# EAGLE design board (EAGLE 9.5.2)
CNAME: Fume Extractor PCB; CREVISION: 1.0; DESIGNER: Kihun Song

## Sheet 1 of 2
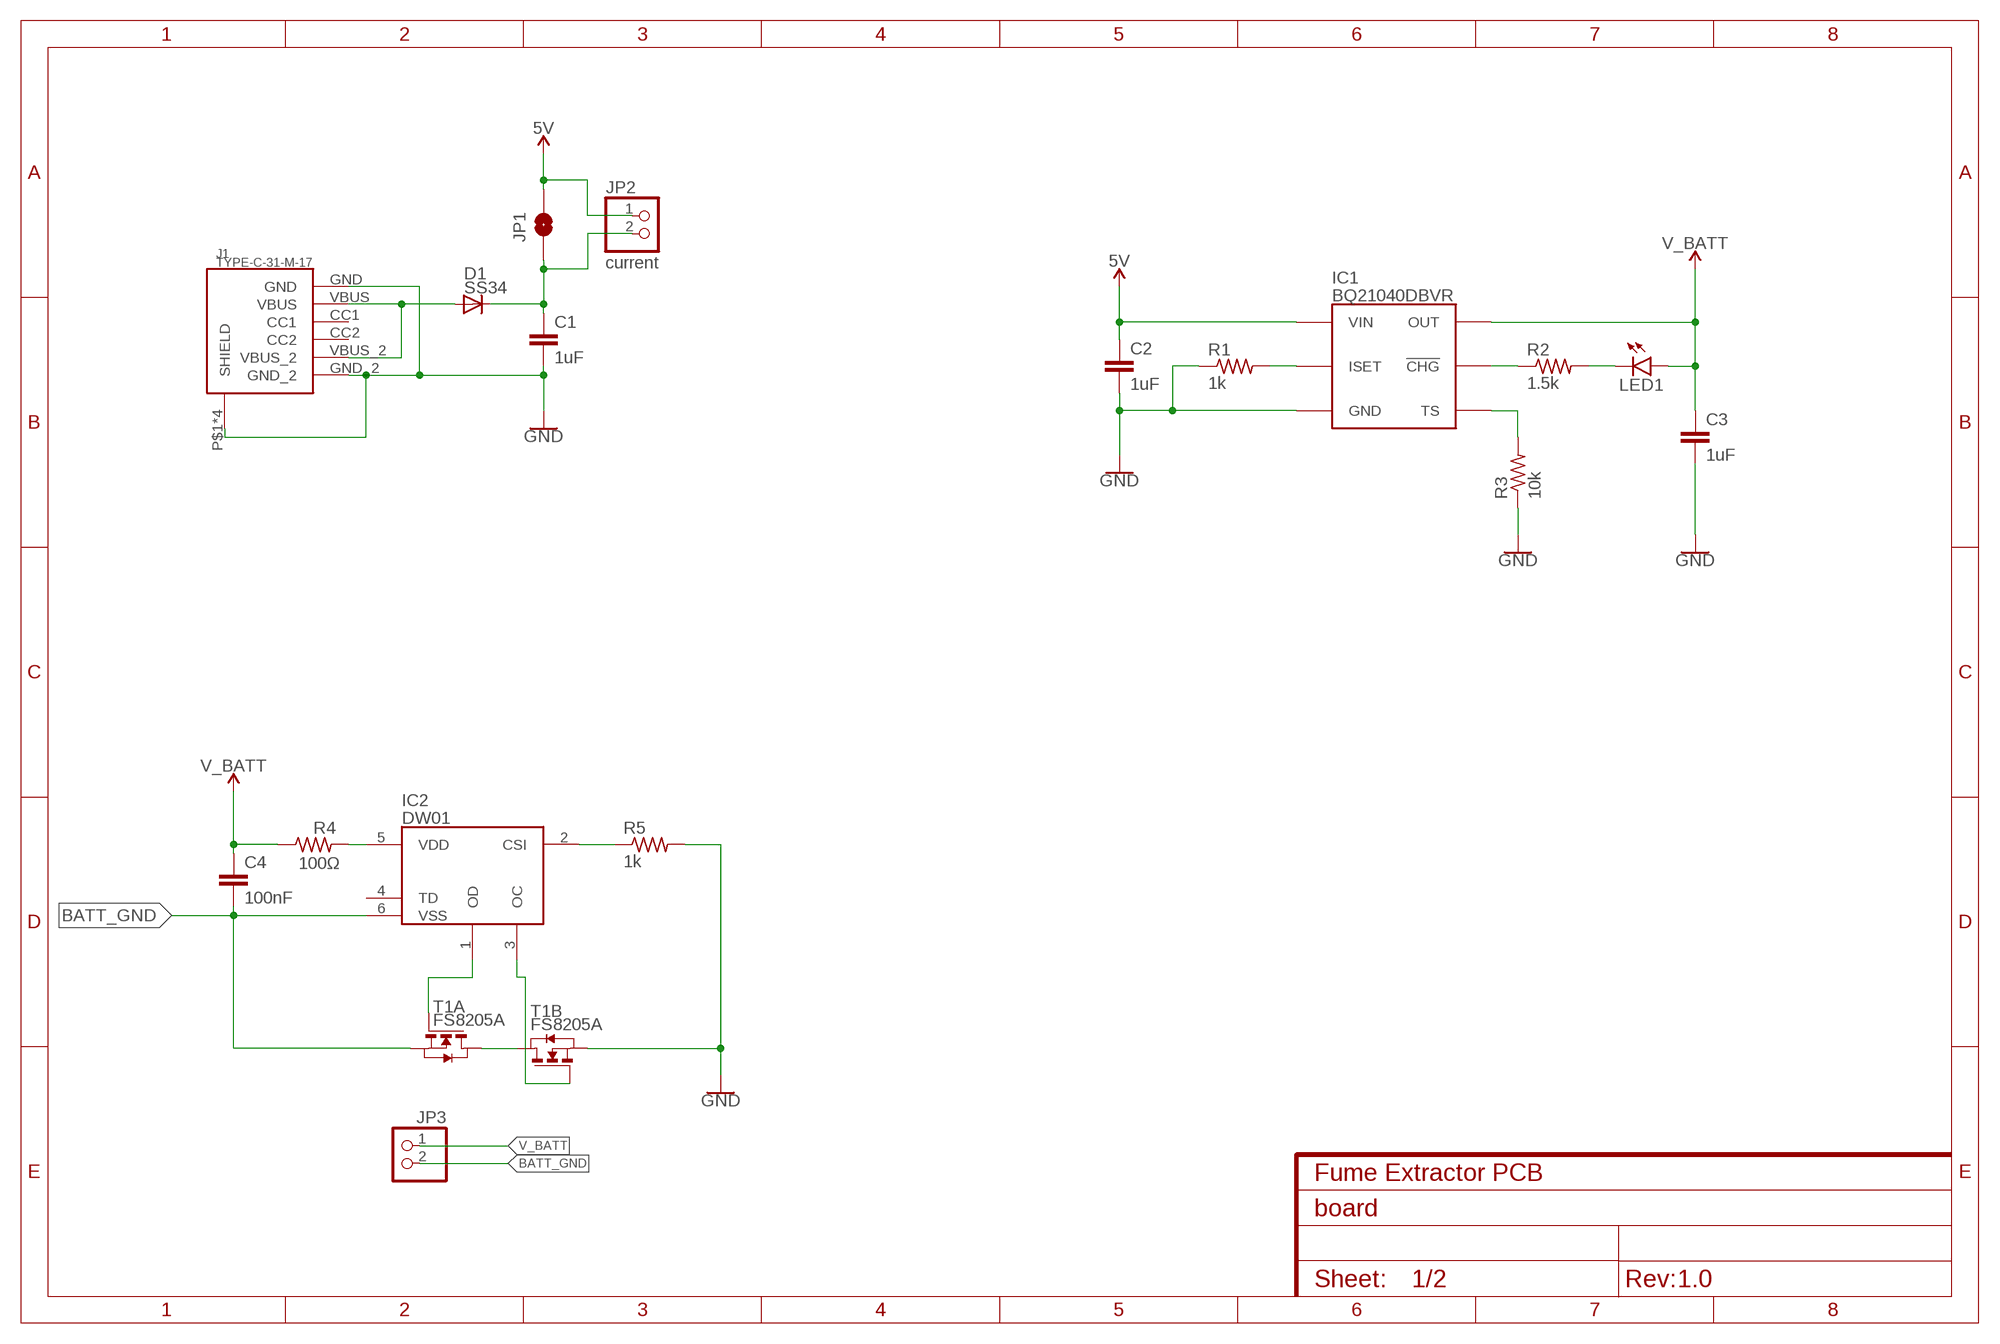
[diagram p0: schematic, sheet 1]

### Parts
C1  1uF  C-EUC0603  [C0603]
C2  1uF  C-EUC0603  [C0603]
C3  1uF  C-EUC0603  [C0603]
C4  100nF  C-EUC0603  [C0603]
D1  SS34  DIODE-DO214AC  [DO214AC]
IC1  BQ21040DBVR  [SOT95P280X145-6N]
IC2  DW01  [SOT95P280X135-6N]
J1  TYPE-C-31-M-17  [TYPE-C-31-M-17]
JP1  JUMPER-SMT_2_NO_NO-SILK  [SMT-JUMPER_2_NO_NO-SILK]
JP2  current  PINHD-1X2/OCT  [1X02/OCT]
JP3  PINHD-1X2/OCT  [1X02/OCT]
LED1  LEDCHIP-LED0805  [CHIP-LED0805]
R1  1k  R-US_R0603  [R0603]
R2  1.5k  R-US_R0603  [R0603]
R3  10k  R-US_R0603  [R0603]
R4  100Ω  R-US_R0603  [R0603]
R5  1k  R-US_R0603  [R0603]
T1  FS8205A  FS8205A-MOSFET  [TSSOP-8]

### Nets
5V [power]: C2.1 IC1.6(VIN) JP1.2 JP2.1 ; also sheet 2
BATT_GND [power]: C4.2 IC2.6(VSS) JP3.2 T1.2(A:S) T1.3(A:S)
GND [power]: C1.2 C2.2 C3.2 IC1.5(GND) J1.GND J1.GND_2 J1.P$1(SHIELD) J1.P$2(SHIELD) J1.P$3(SHIELD) J1.P$4(SHIELD) R1.1 R3.1 R5.2 T1.6(B:S) T1.7(B:S) ; also sheet 2
N$1 [power]: IC2.5(VDD) R4.2
N$2: IC1.1(TS) R3.2
N$3: IC1.3(!CHG) R2.1
N$4: IC2.2(CSI) R5.1
N$5 [power]: T1.1(A:D) T1.8(B:D)
N$6: IC2.1(OD) T1.4(A:G)
N$7: IC2.3(OC) T1.5(B:G)
N$8: LED1.C R2.2
N$9: IC1.4(ISET) R1.2
N$13 [power]: C1.1 D1.C JP1.1 JP2.2
N$14 [power]: D1.A J1.VBUS J1.VBUS_2
V_BATT [power]: C3.1 C4.1 IC1.2(OUT) JP3.1 LED1.A R4.1
Unconnected: IC2.4(TD) J1.CC1 J1.CC2

## Sheet 2 of 2
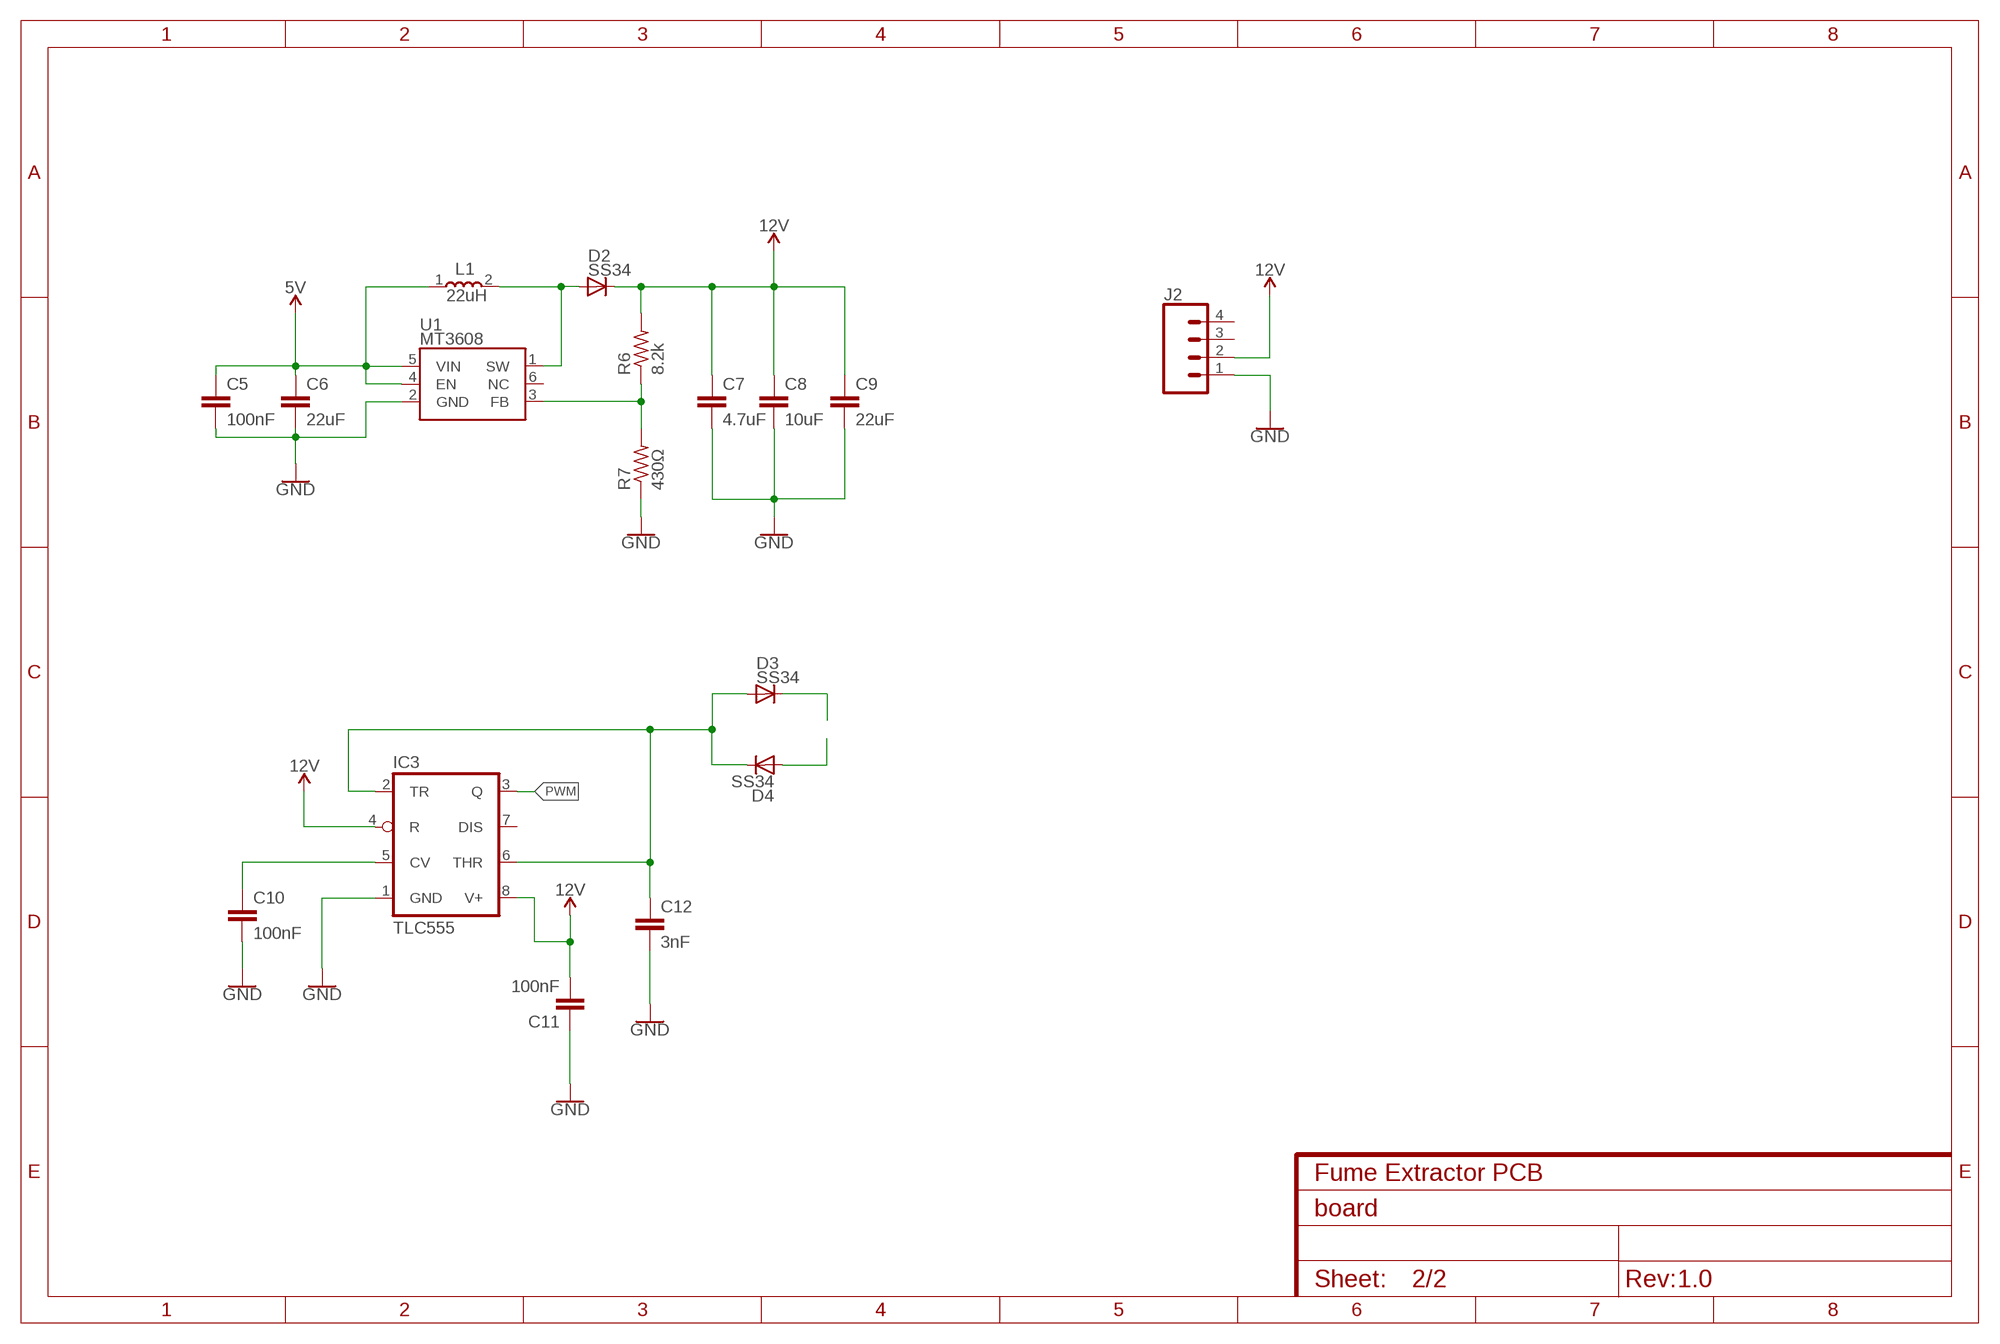
[diagram p1: schematic, sheet 2]

### Parts
C5  100nF  C-EUC0603  [C0603]
C6  22uF  C-EUC0805  [C0805]
C7  4.7uF  C-EUC0603  [C0603]
C8  10uF  C-EUC0805  [C0805]
C9  22uF  C-EUC0805  [C0805]
C10  100nF  C-EUC0603  [C0603]
C11  100nF  C-EUC0603  [C0603]
C12  3nF  C-EUC0603  [C0603]
D2  SS34  DIODE-DO214AC  [DO214AC]
D3  SS34  DIODE-DO214AC  [DO214AC]
D4  SS34  DIODE-DO214AC  [DO214AC]
IC3  TLC555  NE555D  [SO08]
J2  CONN_04POLAR_LOCK  [MOLEX-1X4_LOCK]
L1  22uH  BCIHP0730-220M  [INDPM7066X300N]
R6  8.2k  R-US_R0603  [R0603]
R7  430Ω  R-US_R0603  [R0603]
U1  MT3608  [SOT23-6]

### Nets
5V [power]: C5.1 C6.1 L1.1 U1.4(EN) U1.5(VIN) ; also sheet 1
12V [power]: C7.1 C8.1 C9.1 C11.2 D2.C IC3.4(R) IC3.8(V+) J2.2 R6.2
GND [power]: C5.2 C6.2 C7.2 C8.2 C9.2 C10.2 C11.1 C12.2 IC3.1(GND) J2.1 R7.1 U1.2(GND) ; also sheet 1
N$10 [power]: D2.A L1.2 U1.1(SW)
N$11: C10.1 IC3.5(CV)
N$12: R6.1 R7.2 U1.3(FB)
N$15: C12.1 D3.A D4.C IC3.2(TR) IC3.6(THR)
N$16: D3.C
N$17: D4.A
PWM: IC3.3(Q)
Unconnected: IC3.7(DIS) J2.3 J2.4 U1.6(NC)

## Library data of the parts
C1-C12 = rcl:C-EU: CAPACITOR, European symbol; SPICEPREFIX: C
D1-D4 = diode:DIODE-: DIODE
IC1 = SamacSys_Parts:BQ21040DBVR: 0.8A Single Input Single-Cell Li-Ion and Li-Pol Battery Charger Source: Datasheet <http://www.ti.com/lit/gpn/bq21040>; DESCRIPTION: 0.8A Single Input Single-Cell Li-Ion and Li-Pol Battery Charger; HEIGHT: 1.45mm; MANUFACTURER_NAME: Texas Instruments; MANUFACTURER_PART_NUMBER: BQ21040DBVR; MOUSER_PART_NUMBER: 595-BQ21040DBVR; MOUSER_PRICE-STOCK: https://www.mouser.com/Search/Refine.aspx?Keyword=595-BQ21040DBVR
IC2 = DW01:DW01: ic Source: Datasheet <https://datasheet.lcsc.com/szlcsc/1906271838_SLKORMICRO-Elec-DW01_C359989.pdf>; DESCRIPTION: ic; HEIGHT: 1.35mm; MANUFACTURER_NAME: Slkor; MANUFACTURER_PART_NUMBER: DW01
IC3 = linear:*555: TIMER
J1 = Type-C_Hroparts:TYPE-C-31-M-17
J2 = SparkFun-Connectors:CONN_04: Multi connection point. Often used as Generic Header-pin footprint for 0.1 inch spaced/style header connections On any of the 0.1 inch spaced packages, you can populate with these: Break Away Headers - Straight <https://www.sparkfun.com/products/116> (PRT-00116) Break Away Male Headers - Right Angle <https://www.sparkfun.com/products/553> (PRT-00553) Female Headers <https://www.sparkfun.com/products/115> (PRT-00115) Break Away Headers - Machine Pin <https://www.sparkfun.com/products/117> (PRT-00117) Break Away Female Headers - Swiss Machine Pin <https://www.sparkfun.com/products/743> (PRT-00743) For SCREWTERMINALS and SPRING TERMINALS visit here: Screw Terimnals on SparkFun.com <https://www.sparkfun.com/search/results?term=Screw+Terminals> (5mm/3.5mm/2.54mm spacing) This device is also useful as a general connection point to wire up your design to another part of your project. Our various solder wires solder well into these plated through hole pads. Hook-Up Wire - Assortment (Stranded, 22 AWG) <https://www.sparkfun.com/products/11375> (PRT-11375) Hook-Up Wire - Assortment (Solid Core, 22 AWG) <https://www.sparkfun.com/products/11367> (PRT-11367) View the entire wire category on our website here <https://www.sparkfun.com/categories/141> Special notes: Molex polarized connector foot print use with SKU : PRT-08231 with associated crimp pins and housings. 1MM SMD Version SKU: PRT-10208; PROD_ID: CONN-08186; SF_ID: PRT-08231
JP1 = SparkFun-Jumpers:JUMPER-SMT_2_NO: Normally open jumper This jumper has two pads in close proximity to each other. Apply solder to close the connection. Round pads are easier to solder for beginners, but are a lot larger. SparkFun Product that uses the round pads: SparkFun EL Sequencer <https://www.sparkfun.com/products/12781>
JP2 JP3 = pinhead_v2:PINHD-1X2: PIN HEADER
L1 = BCIHP0730-220M:BCIHP0730-220M: Inductors (SMD) SMD,7x7x3mm RoHS Source: Datasheet <https://datasheet.lcsc.com/szlcsc/Bao-Cheng-Elec-BC-BCIHP0730-220M_C237916.pdf>; DESCRIPTION: Inductors (SMD) SMD,7x7x3mm RoHS; HEIGHT: 3mm; MANUFACTURER_NAME: Bao Cheng Elec; MANUFACTURER_PART_NUMBER: BCIHP0730-220M
LED1 = led:LED: LED OSRAM: - CHIPLED LG R971, LG N971, LY N971, LG Q971, LY Q971, LO R971, LY R971 LH N974, LH R974 LS Q976, LO Q976, LY Q976 LO Q996 - Hyper CHIPLED LW Q18S LB Q993, LB Q99A, LB R99A - SideLED LS A670, LO A670, LY A670, LG A670, LP A670 LB A673, LV A673, LT A673, LW A673 LH A674 LY A675 LS A676, LA A676, LO A676, LY A676, LW A676 LS A679, LY A679, LG A679 - Hyper Micro SIDELED® LS Y876, LA Y876, LO Y876, LY Y876 LT Y87S - SmartLED LW L88C, LW L88S LB L89C, LB L89S, LG L890 LS L89K, LO L89K, LY L89K LS L896, LA L896, LO L896, LY L896 - TOPLED LS T670, LO T670, LY T670, LG T670, LP T670 LSG T670, LSP T670, LSY T670, LOP T670, LYG T670 LG T671, LOG T671, LSG T671 LB T673, LV T673, LT T673, LW T673 LH T674 LS T676, LA T676, LO T676, LY T676, LB T676, LH T676, LSB T676, LW T676 LB T67C, LV T67C, LT T67C, LS T67K, LO T67K, LY T67K, LW E67C LS E67B, LA E67B, LO E67B, LY E67B, LB E67C, LV E67C, LT E67C LW T67C LS T679, LY T679, LG T679 LS T770, LO T770, LY T770, LG T770, LP T770 LB T773, LV T773, LT T773, LW T773 LH T774 LS E675, LA E675, LY E675, LS T675 LS T776, LA T776, LO T776, LY T776, LB T776 LHGB T686 LT T68C, LB T68C - Hyper Mini TOPLED® LB M676 - Mini TOPLED Santana® LG M470 LS M47K, LO M47K, LY M47K Source: http://www.osram.convergy.de LUXEON: - LUMILED® LXK2-PW12-R00, LXK2-PW12-S00, LXK2-PW14-U00, LXK2-PW14-V00 LXK2-PM12-R00, LXK2-PM12-S00, LXK2-PM14-U00 LXK2-PE12-Q00, LXK2-PE12-R00, LXK2-PE12-S00, LXK2-PE14-T00, LXK2-PE14-U00 LXK2-PB12-K00, LXK2-PB12-L00, LXK2-PB12-M00, LXK2-PB14-N00, LXK2-PB14-P00, LXK2-PB14-Q00 LXK2-PR12-L00, LXK2-PR12-M00, LXK2-PR14-Q00, LXK2-PR14-R00 LXK2-PD12-Q00, LXK2-PD12-R00, LXK2-PD12-S00 LXK2-PH12-R00, LXK2-PH12-S00 LXK2-PL12-P00, LXK2-PL12-Q00, LXK2-PL12-R00 Source: www.luxeon.com KINGBRIGHT: KA-3528ASYC Source: www.kingbright.com
R1-R7 = rcl:R-US_: RESISTOR, American symbol; SPICEPREFIX: R
T1 = FS8205A:FS8205A-MOSFET: DUAL N-CHANNEL ENHANCEMENT MODE MOSFET data sheet <http://goo.gl/dRgboR> Dave.Calaway Eagle Library <https://goo.gl/Muy1Tr>
U1 = buckboost:MT3608

## Net classes
0 default: width 0.203 mm
1 power: width 0.457 mm

## Board
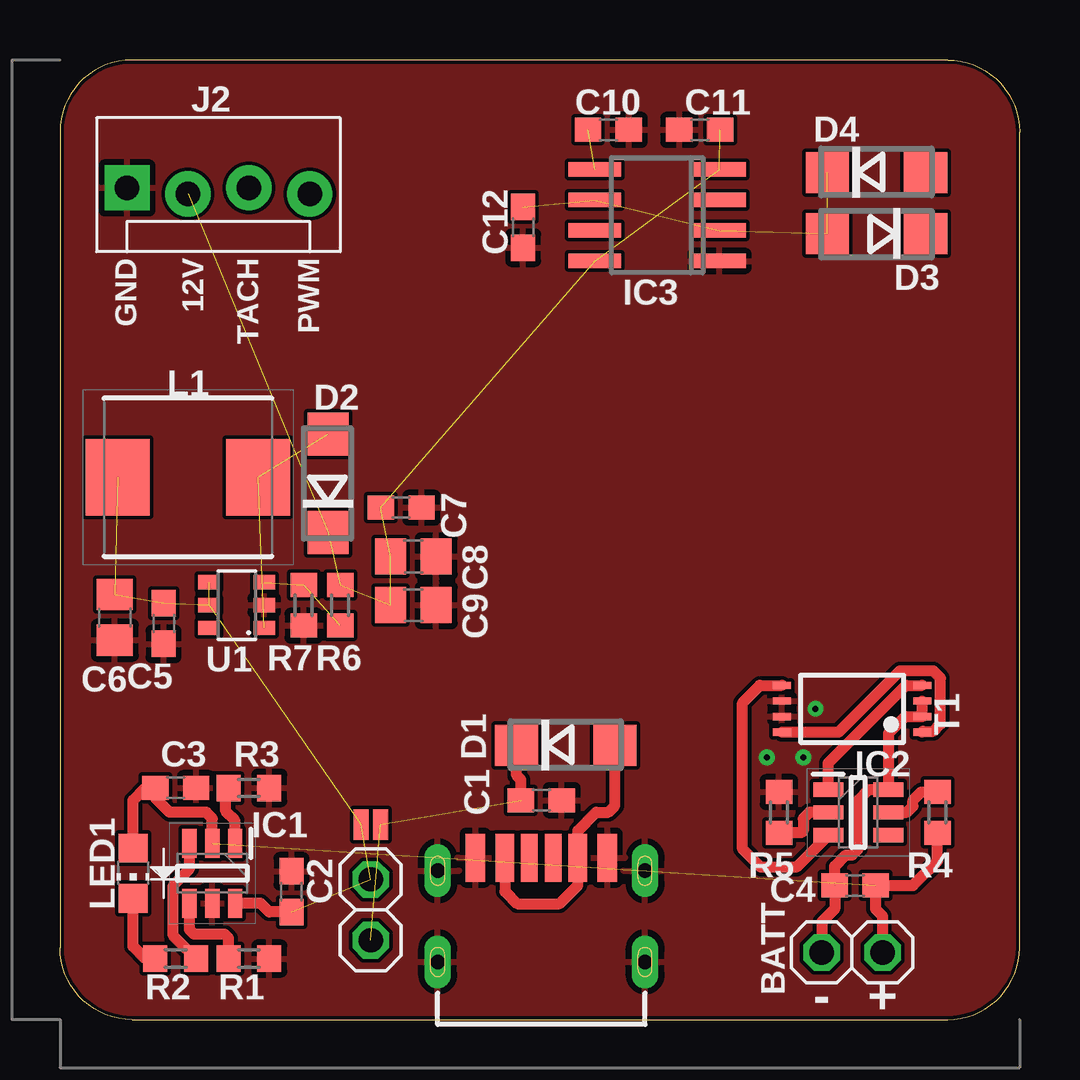
[diagram p2: board, top side]
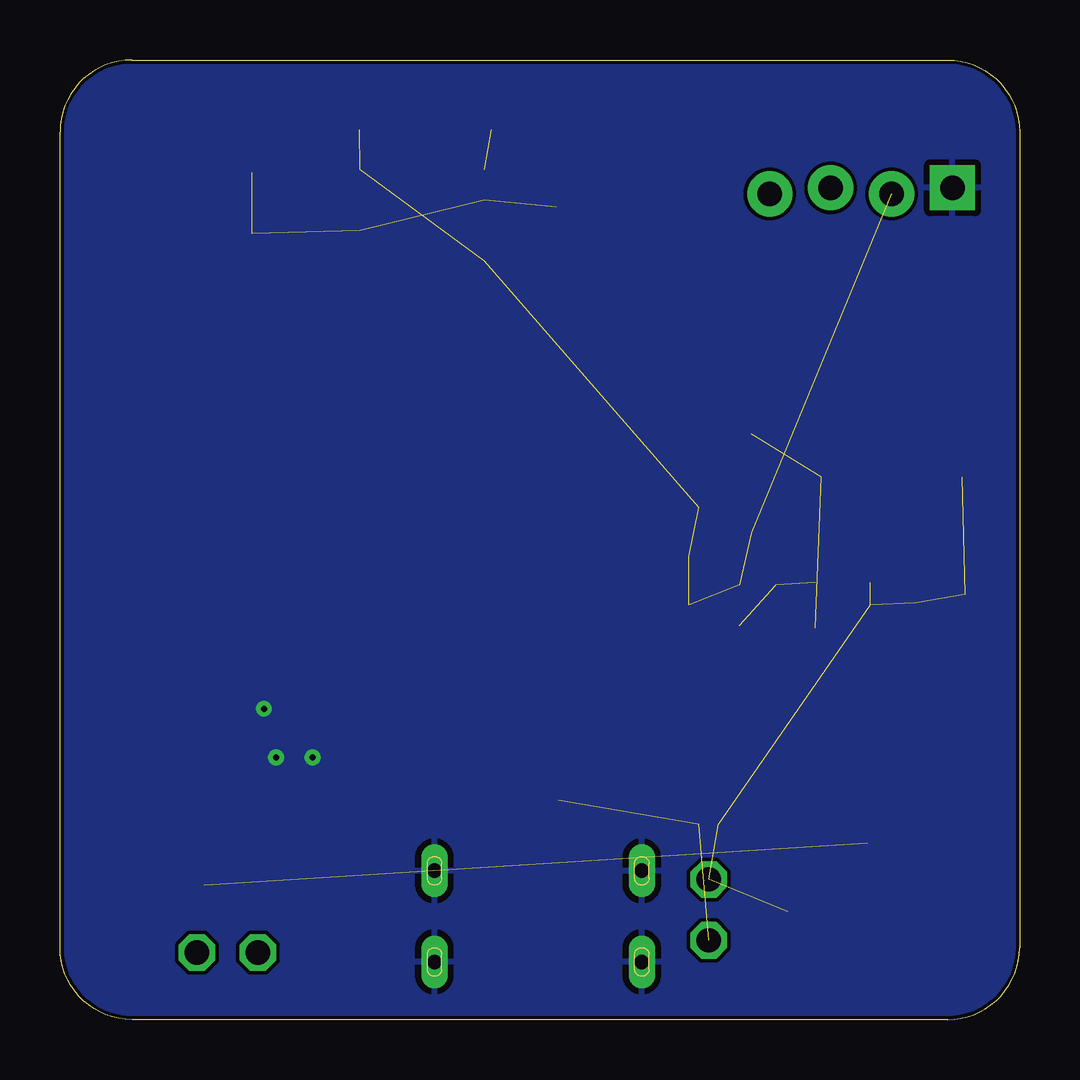
[diagram p3: board, bottom side, seen from below]

Size 40 x 40 mm. Coordinates in mm from the lower left corner, seen from the top.
Outline: 3,0 37,0 arc90 40,3 40,37 arc90 37,40 3,40 arc90 0,37 0,3 arc90 3,0
Copper layers (1*16): Top 0.035mm / dielectric 1.5mm / Bottom 0.035mm
Design rules "default *": minimum track width 6mil, minimum drill 0.35mm, track to track 6mil, track to pad 6mil, pad to pad 6mil, via to via 6mil, smd to smd 6mil, copper to edge 6mil, drill to drill 6mil, minimum pad ring 10mil, minimum via ring 8mil, stop-mask expansion 4mil, vias tented up to drill 0mil, thermal gap 10mil

### Footprints (pad centres in the part's own frame; a part is rotated, then mirrored left to right if it is on the bottom)
C0603 = smd 1.1 x 1: 1 -0.85,0; 2 0.85,0
C0805 = smd 1.3 x 1.5: 1 -0.95,0; 2 0.95,0
DO214AC = smd 1.8 x 1.7: A 2.05,0; C -2.05,0
SOT95P280X145-6N = smd 1.2 x 0.6: 1 -1.25,0.95; 2 -1.25,0; 3 -1.25,-0.95; 4 1.25,-0.95; 5 1.25,0; 6 1.25,0.95
SOT95P280X135-6N = smd 1.25 x 0.6: 1 -1.25,0.95; 2 -1.25,0; 3 -1.25,-0.95; 4 1.25,-0.95; 5 1.25,0; 6 1.25,0.95
SO08 = smd 0.6 x 2.2: 1 -1.905,-2.6; 2 -0.635,-2.6; 3 0.635,-2.6; 4 1.905,-2.6; 5 1.905,2.6; 6 0.635,2.6; 7 -0.635,2.6; 8 -1.905,2.6
TYPE-C-31-M-17 = smd 0.7 x 2: CC1 -0.5,0.4; CC2 0.5,0.4 | smd 0.8 x 2: GND -2.75,0.4; GND_2 2.75,0.4 | drill 0.6 pad 1.1 long: P$1 4.32,-3.95; P$2 4.32,-0.15; P$3 -4.32,-0.15; P$4 -4.32,-3.95 | smd 0.76 x 2: VBUS -1.52,0.4; VBUS_2 1.52,0.4
MOLEX-1X4_LOCK = drill 1.016 pad 1.88 square: 1 0,0.127 | drill 1.016 pad 1.88: 2 2.54,-0.127; 3 5.08,0.127; 4 7.62,-0.127
SMT-JUMPER_2_NO_NO-SILK = smd 0.635 x 1.27: 1 -0.406,0; 2 0.406,0
1X02/OCT = drill 1.016 octagon: 1 -1.27,0; 2 1.27,0
INDPM7066X300N = smd 2.65 x 3.2: 1 -2.927,0; 2 2.927,0
CHIP-LED0805 = smd 1.2 x 1.2: A 0,-1.05; C 0,1.05
R0603 = smd 1 x 1.1: 1 -0.85,0; 2 0.85,0
TSSOP-8 = smd 0.3 x 0.75: 1 -0.975,-2.925; 2 -0.325,-2.925; 3 0.325,-2.925; 4 0.975,-2.925; 5 0.975,2.925; 6 0.325,2.925; 7 -0.325,2.925; 8 -0.975,2.925
SOT23-6 = smd 0.6 x 0.9: 1 -0.95,-1.15; 2 0,-1.15; 3 0.95,-1.15; 4 0.95,1.15; 5 0,1.15; 6 -0.95,1.15

### Placement (x,y rotation side)
C1  20.07,9.14 0 top
C2  9.65,5.33 90 top
C3  4.83,9.65 0 top
C4  33.15,5.59 180 top
C5  4.32,16.51 270 top
C6  2.29,16.76 270 top
C7  14.22,21.34 0 top
C8  14.73,19.3 0 top
C9  14.73,17.27 0 top
C10  22.86,37.08 0 top
C11  26.67,37.08 0 top
C12  19.3,33.02 270 top
D1  21.08,11.43 0 top
D2  11.18,22.35 90 top
D3  34.04,32.77 180 top
D4  34.04,35.31 0 top
IC1  6.35,6.1 270 top
IC2  33.27,8.64 0 top
IC3  24.89,33.53 90 top
J1  20.07,6.35 0 top
J2  2.79,34.54 0 top
JP1  12.95,8.13 180 top
JP2  12.95,4.57 270 top
JP3  33.02,2.79 180 top
L1  5.33,22.61 0 top
LED1  3.05,6.1 180 top
R1  7.87,2.54 180 top
R2  4.83,2.54 180 top
R3  7.87,9.65 180 top
R4  36.58,8.64 90 top
R5  29.97,8.64 90 top
R6  11.68,17.27 90 top
R7  10.16,17.27 90 top
T1  33.02,12.95 90 top
U1  7.37,17.27 90 top

### Tracks (layer width: path | path; a pad name or v marks a point on that pad's centre or on a via)
5V  (7 unrouted)
  Top 0.457: C2.1 8.72,4.48 8.36,4.85 IC1.6
12V  (8 unrouted)
BATT_GND  (1 unrouted)
  Top 0.457: T1.3 T1.2 35.23,12.63 34.54,11.94 34.54,9.61 IC2.6 33.72,9.59 33.27,9.14 33.27,7.11 33.02,6.86 32.77,6.86 32.3,6.39 C4.2 32.3,4.61 31.75,4.06 JP3.2
GND  (via drill 0.25)
  other vias: 31.5,12.95 29.46,10.92 30.99,10.92
  pour Top: 0,40 40,40 40,0 0,0
  pour Bottom: 0,40 40,40 40,0 0,0
N$1
  Top 0.457: IC2.5 35.31,8.64 35.56,8.89 35.56,9.14 35.9,9.49 R4.2
N$2
  Top 0.457: IC1.1 7.3,8.29 6.91,8.69 6.91,9.54 R3.2
N$3
  Top 0.457: IC1.3 5.4,6.29 4.72,5.6 4.72,3.5 R2.1
N$4
  Top 0.457: IC2.2 31.24,8.64 30.99,8.38 30.99,7.87 30.9,7.79 R5.1
N$5
  Top 0.457: T1.8 32.45,11.98 35.01,14.54 36.4,14.54 36.7,14.24 36.7,12.32 36.4,12.02 35.98,12.02 T1.1
N$6
  Top 0.457: IC2.1 32.02,10.69 35.27,13.93 T1.4
N$7
  Top 0.457: IC2.3 30.69,6.35 29.21,6.35 28.45,7.11 28.45,13.21 29.17,13.93 T1.5
N$8
  Top 0.457: R2.2 3.56,2.54 3.05,3.05 LED1.C
N$9
  Top 0.457: R1.2 7.02,3.39 6.86,3.56 5.59,3.56 5.4,3.74 IC1.4
N$10  (2 unrouted)
N$11  (1 unrouted)
N$12  (2 unrouted)
N$13  (2 unrouted)
  Top 0.457: C1.1 19.22,9.99 19.03,10.18 D1.C
N$14
  Top 0.457: D1.A 23.13,8.91 22.86,8.64 22.35,8.64 21.59,7.87 J1.VBUS_2 21.59,5.58 20.83,4.83 19.06,4.83 18.55,5.34 | J1.VBUS 18.55,5.34 | 18.55,5.34 18.54,5.33
N$15  (4 unrouted)
V_BATT  (1 unrouted)
  Top 0.457: LED1.A 3.05,9.14 3.56,9.65 C3.1 3.98,9.23 4.57,8.64 6.1,8.64 6.35,8.38 IC1.2 | R4.1 36.58,6.6 35.56,5.59 C4.1 34,4.61 34.29,4.32 JP3.1

### Text on the board
tPlace: GND | 12V | TACH | PWM | BATT | - | +